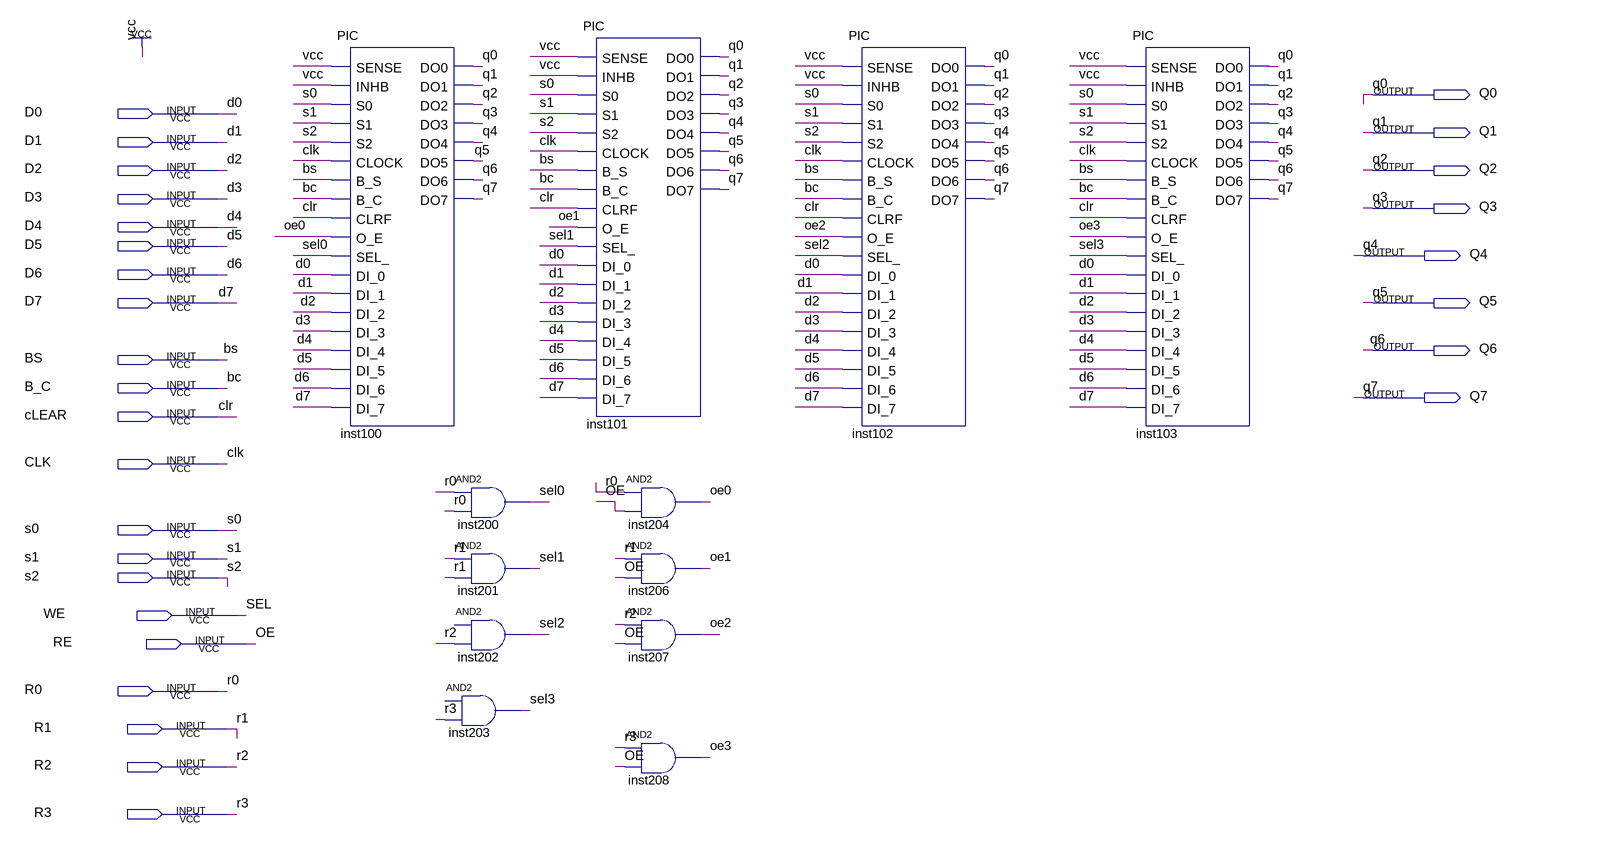
[diagram p0: schematic sheet]
// Quartus schematic RAM_raulberto.bdf as structural Verilog: 12 symbols, 29 pins
module RAM_raulberto (
  input  D0,
  input  D1,
  input  D2,
  input  D3,
  input  D4,
  input  D5,
  input  D6,
  input  D7,
  input  BS,
  input  B_C,
  input  cLEAR,
  input  CLK,
  input  s0,
  input  s1,
  input  s2,
  input  WE,
  input  RE,
  input  R0,
  input  R1,
  input  R2,
  input  R3,
  output Q0,
  output Q1,
  output Q2,
  output Q3,
  output Q4,
  output Q5,
  output Q6,
  output Q7
);

  wire oe0, oe1, oe2, oe3, sel0, sel1, sel2, sel3;

  PIC inst100 (
    .SENSE(1'b1), .INHB(1'b1), .S0(s0), .S1(s1), .S2(s2), .CLOCK(CLK), .B_S(BS), .B_C(B_C), .CLRF(cLEAR),
    .O_E(oe0), .SEL_(sel0), .DI_0(D0), .DI_1(D1), .DI_2(D2), .DI_3(D3), .DI_4(D4), .DI_5(D5), .DI_6(D6),
    .DI_7(D7), .DO0(Q0), .DO1(Q1), .DO2(Q2), .DO3(Q3), .DO4(Q4), .DO5(Q5), .DO6(Q6), .DO7(Q7));
  and inst200 (sel0, R0, R0);
  and inst201 (sel1, R1, R1);
  buf inst202 (sel2, R2);  // AND2 open: IN1
  buf inst203 (sel3, R3);  // AND2 open: IN1
  PIC inst101 (
    .SENSE(1'b1), .INHB(1'b1), .S0(s0), .S1(s1), .S2(s2), .CLOCK(CLK), .B_S(BS), .B_C(B_C), .CLRF(cLEAR),
    .O_E(oe1), .SEL_(sel1), .DI_0(D0), .DI_1(D1), .DI_2(D2), .DI_3(D3), .DI_4(D4), .DI_5(D5), .DI_6(D6),
    .DI_7(D7), .DO0(Q0), .DO1(Q1), .DO2(Q2), .DO3(Q3), .DO4(Q4), .DO5(Q5), .DO6(Q6), .DO7(Q7));
  and inst204 (oe0, R0, RE);
  and inst206 (oe1, R1, RE);
  and inst207 (oe2, R2, RE);
  and inst208 (oe3, R3, RE);
  PIC inst102 (
    .SENSE(1'b1), .INHB(1'b1), .S0(s0), .S1(s1), .S2(s2), .CLOCK(CLK), .B_S(BS), .B_C(B_C), .CLRF(cLEAR),
    .O_E(oe2), .SEL_(sel2), .DI_0(D0), .DI_1(D1), .DI_2(D2), .DI_3(D3), .DI_4(D4), .DI_5(D5), .DI_6(D6),
    .DI_7(D7), .DO0(Q0), .DO1(Q1), .DO2(Q2), .DO3(Q3), .DO4(Q4), .DO5(Q5), .DO6(Q6), .DO7(Q7));
  PIC inst103 (
    .SENSE(1'b1), .INHB(1'b1), .S0(s0), .S1(s1), .S2(s2), .CLOCK(CLK), .B_S(BS), .B_C(B_C), .CLRF(cLEAR),
    .O_E(oe3), .SEL_(sel3), .DI_0(D0), .DI_1(D1), .DI_2(D2), .DI_3(D3), .DI_4(D4), .DI_5(D5), .DI_6(D6),
    .DI_7(D7), .DO0(Q0), .DO1(Q1), .DO2(Q2), .DO3(Q3), .DO4(Q4), .DO5(Q5), .DO6(Q6), .DO7(Q7));

  // Other names for the same wires on the sheet: bc = B_C; clr = cLEAR; OE = RE; SEL = WE
endmodule
